# EAGLE design Arduino Sheild (EAGLE 6.2)
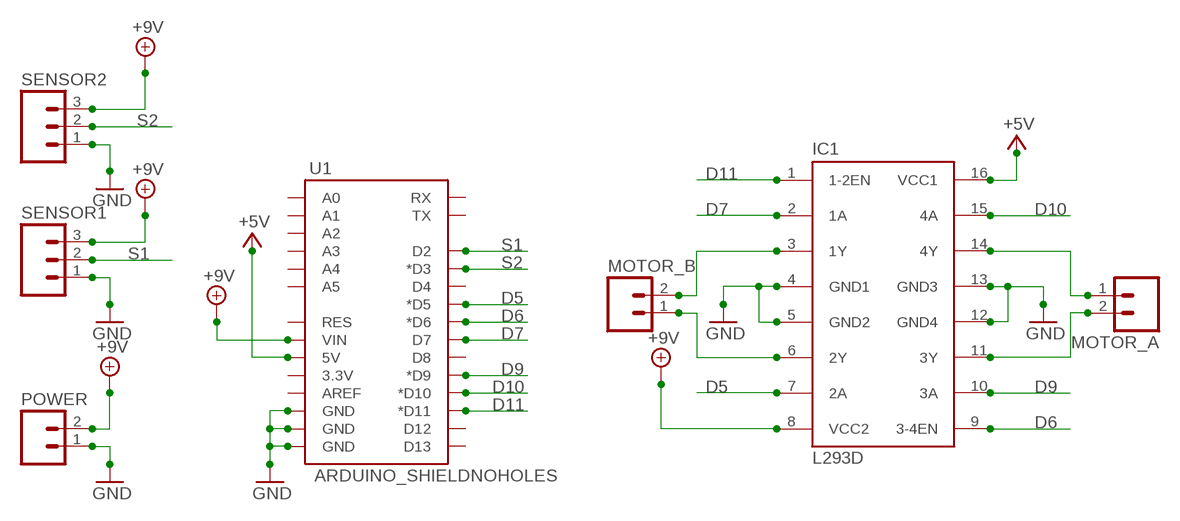
[diagram p0: schematic, sheet 1]

## Parts
IC1  L293D  [DIL16]
MOTOR_A  M02  [02P]
MOTOR_B  M02  [02P]
POWER  M02  [02P]
SENSOR1  M03  [03P]
SENSOR2  M03  [03P]
U1  ARDUINO_SHIELDNOHOLES  [DUEMILANOVE_SHIELD_NOHOLES]

## Nets
+5V: IC1.16(VCC1) U1.5V
+9V: IC1.8(VCC2) POWER.2 SENSOR1.3 SENSOR2.3 U1.VIN
D5: IC1.7(2A) U1.D5(*D5)
D6: IC1.9(3-4EN) U1.D6(*D6)
D7: IC1.2(1A) U1.D7
D9: IC1.10(3A) U1.D9(*D9)
D10: IC1.15(4A) U1.D10(*D10)
D11: IC1.1(1-2EN) U1.D11(*D11)
GND: IC1.4(GND1) IC1.5(GND2) IC1.12(GND4) IC1.13(GND3) POWER.1 SENSOR1.1 SENSOR2.1 U1.GND@0(GND) U1.GND@1(GND) U1.GND@2(GND)
N$3: IC1.3(1Y) MOTOR_B.2
N$4: IC1.6(2Y) MOTOR_B.1
N$5: IC1.14(4Y) MOTOR_A.1
N$6: IC1.11(3Y) MOTOR_A.2
S1: SENSOR1.2 U1.D2
S2: SENSOR2.2 U1.D3(*D3)
Unconnected: U1.3.3V U1.A0 U1.A1 U1.A2 U1.A3 U1.A4 U1.A5 U1.AREF U1.D4 U1.D8 U1.D12 U1.D13 U1.RES U1.RX U1.TX

## Library data of the parts
IC1 = st-microelectronics:L293D: PUSH-PULL 4 CHANNEL DRIVER; MPN: L293D; OC_FARNELL: 9589619; OC_NEWARK: 56P8249
MOTOR_A MOTOR_B POWER = con-amp-quick:M02: AMP QUICK CONNECTOR; OC_FARNELL: unknown; OC_NEWARK: unknown
SENSOR1 SENSOR2 = con-amp-quick:M03: AMP QUICK CONNECTOR; OC_FARNELL: unknown; OC_NEWARK: unknown
U1 = SparkFun-Boards:ARDUINO_SHIELD: Arduino shield footprint

## Board
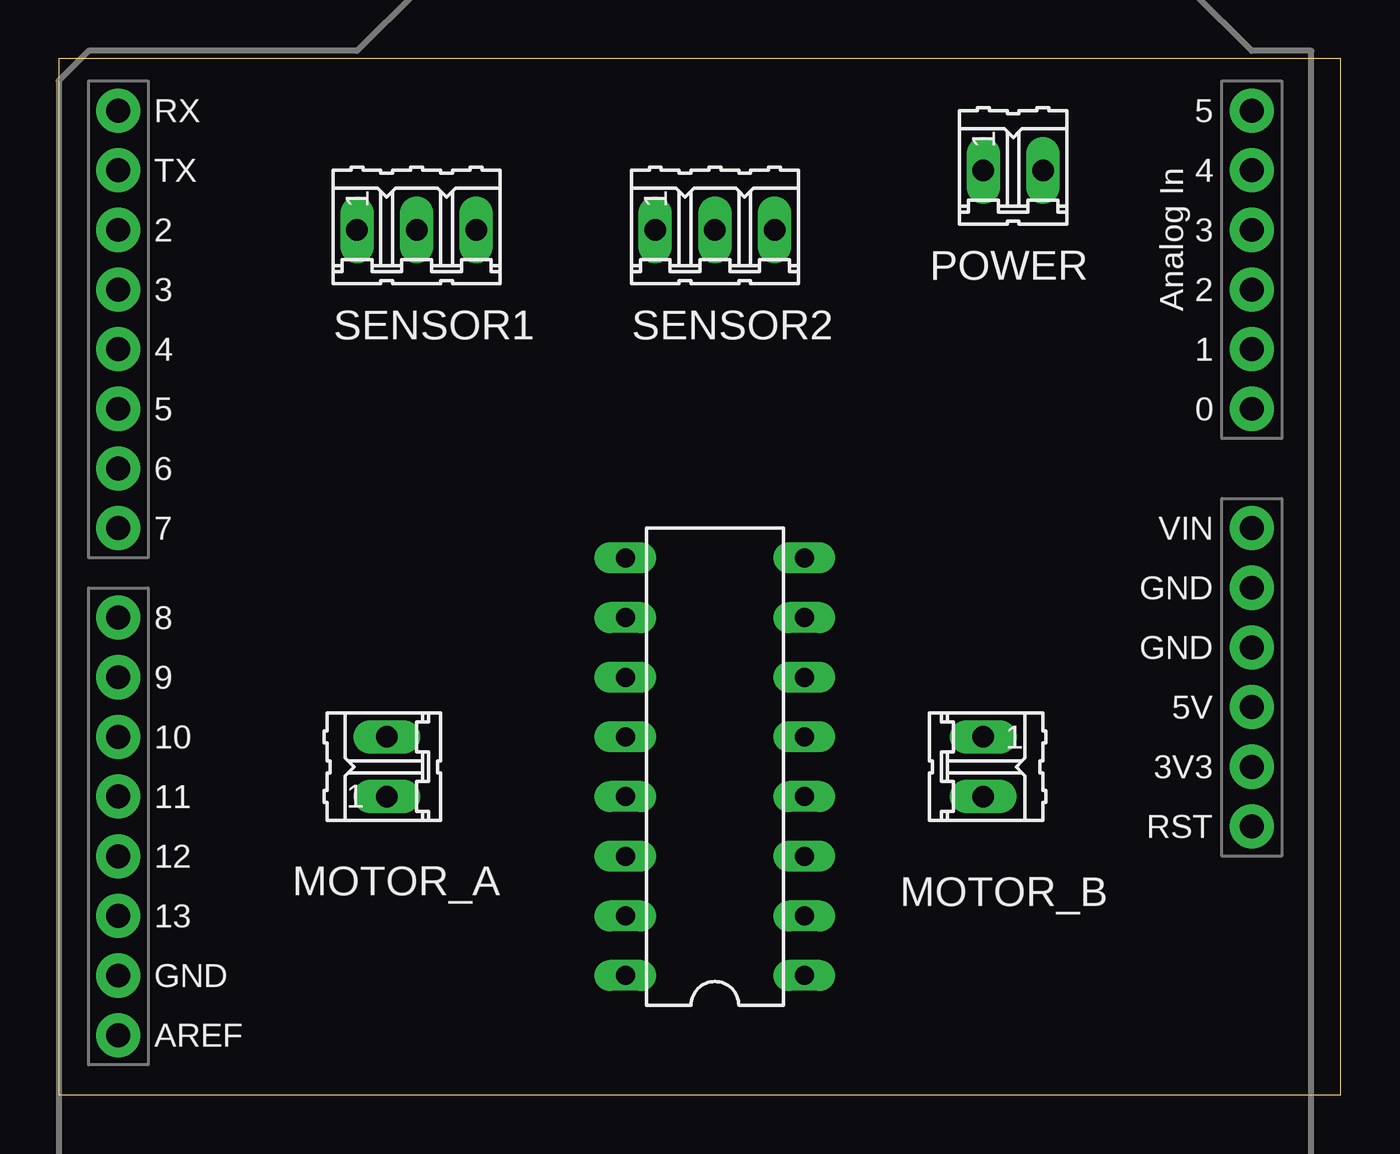
[diagram p1: board, top side]
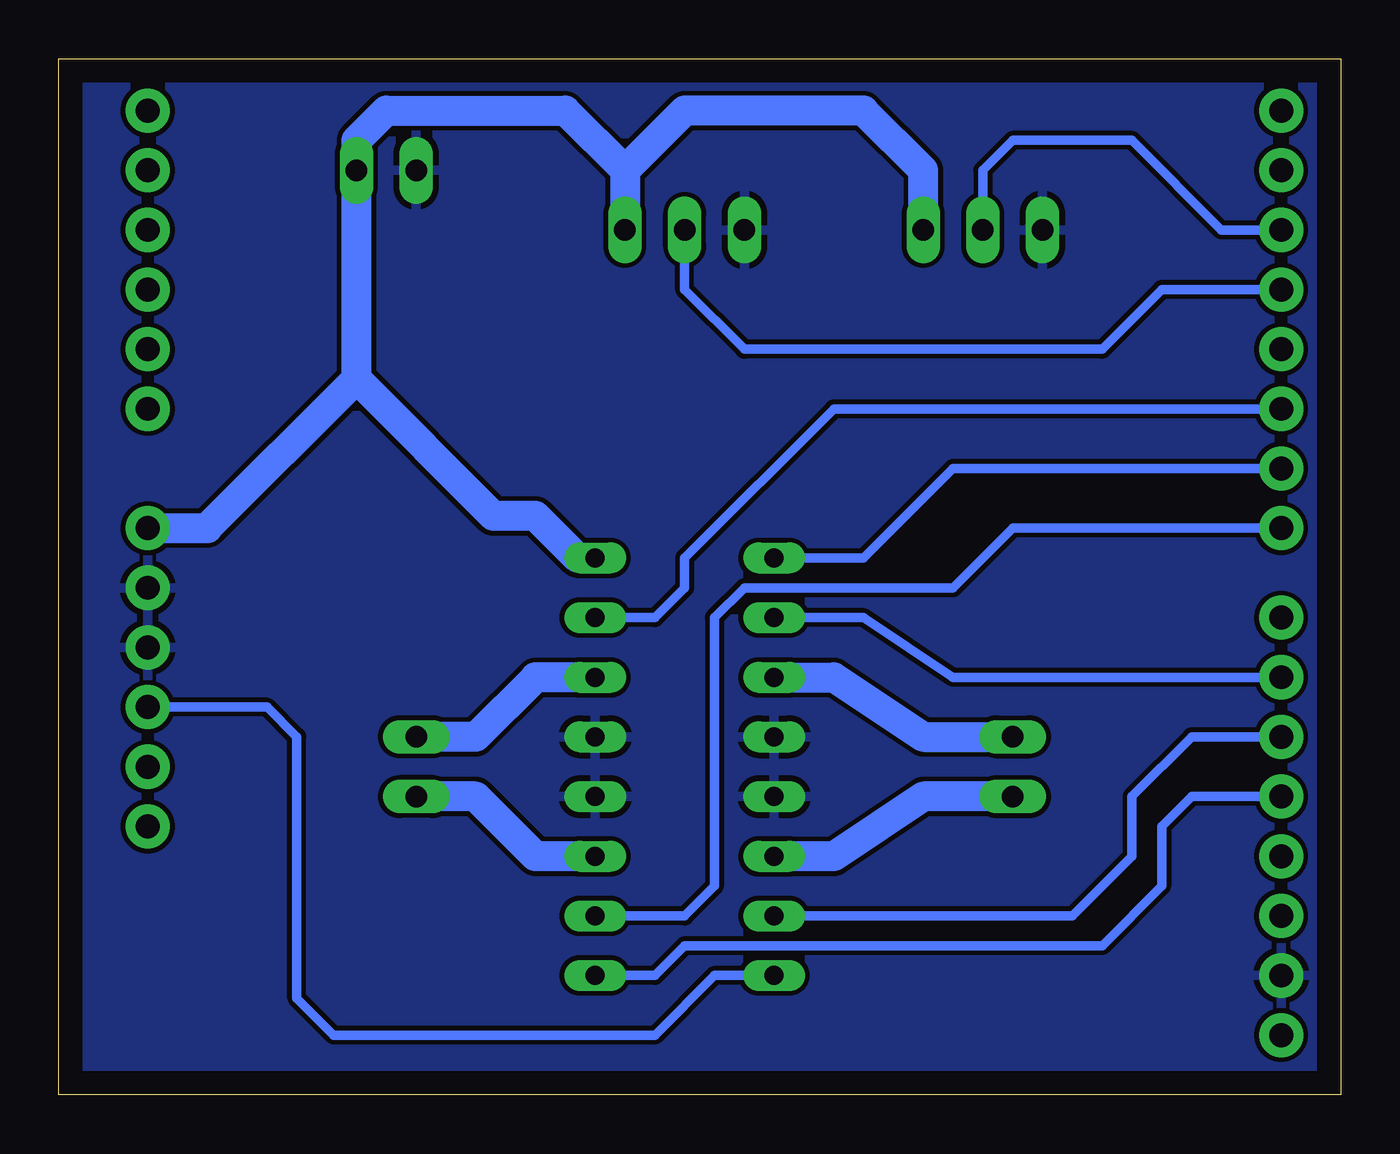
[diagram p2: board, bottom side, seen from below]

Size 54.59 x 44.12 mm. Coordinates in mm from the lower left corner, seen from the top.
Outline: 0,0 54.59,0 54.59,44.12 0,44.12 0,0
Copper layers (1*16): Top 0.035mm / dielectric 1.5mm / Bottom 0.035mm
Design rules: minimum track width 10mil, minimum drill 24mil, track to track 8mil, track to pad 8mil, pad to pad 8mil, via to via 8mil, smd to smd 8mil, copper to edge 40mil, drill to drill 8mil, minimum pad ring 10mil, minimum via ring 8mil, stop-mask expansion 4mil, vias tented up to drill 0mil, thermal gap 10mil

### Footprints (pad centres in the part's own frame; a part is rotated, then mirrored left to right if it is on the bottom)
DIL16 = drill 0.813 long: 1 -8.89,-3.81; 2 -6.35,-3.81; 3 -3.81,-3.81; 4 -1.27,-3.81; 5 1.27,-3.81; 6 3.81,-3.81; 7 6.35,-3.81; 8 8.89,-3.81; 9 8.89,3.81; 10 6.35,3.81; 11 3.81,3.81; 12 1.27,3.81; 13 -1.27,3.81; 14 -3.81,3.81; 15 -6.35,3.81; 16 -8.89,3.81
02P = drill 0.914 long: 1 -1.27,0; 2 1.27,0
03P = drill 0.914 long: 1 -2.54,0; 2 0,0; 3 2.54,0
DUEMILANOVE_SHIELD_NOHOLES = drill 1.016 pad 1.88: 3.3V 50.8,26.67; 5V 50.8,29.21; A0 50.8,41.91; A1 50.8,44.45; A2 50.8,46.99; A3 50.8,49.53; A4 50.8,52.07; A5 50.8,54.61; AREF 2.54,15.24; D2 2.54,49.53; D3 2.54,46.99; D4 2.54,44.45; D5 2.54,41.91; D6 2.54,39.37; D7 2.54,36.83; D8 2.54,33.02; D9 2.54,30.48; D10 2.54,27.94; D11 2.54,25.4; D12 2.54,22.86; D13 2.54,20.32; GND@0 50.8,31.75; GND@1 50.8,34.29; GND@2 2.54,17.78; RES 50.8,24.13; RX 2.54,54.61; TX 2.54,52.07; VIN 50.8,36.83

### Placement (x,y rotation side)
IC1  27.94,13.97 90 top
MOTOR_A  13.97,13.97 90 top
MOTOR_B  39.37,13.97 270 top
POWER  40.64,39.37 0 top
SENSOR1  15.24,36.83 0 top
SENSOR2  27.94,36.83 0 top
U1  0,-12.7 0 top

### Tracks (layer width: path | path; a pad name or v marks a point on that pad's centre or on a via)
+5V
  Bottom 0.406: IC1.16 26.67,5.08 29.21,2.54 42.88,2.54 44.45,4.11 44.45,15.24 45.72,16.51 U1.5V
+9V
  Bottom 1.27: IC1.8 32.49,22.86 34.29,24.66 36.09,24.66 41.91,30.48 | U1.VIN 48.26,24.13 41.91,30.48 | 41.91,30.48 POWER.2 41.91,40.64 40.64,41.91 33.02,41.91 30.48,39.37 | SENSOR1.3 17.78,39.37 20.32,41.91 27.94,41.91 30.48,39.37 | 30.48,39.37 SENSOR2.3
D5
  Bottom 0.406: U1.D5 21.59,29.21 27.94,22.86 27.94,21.59 29.21,20.32 IC1.7
D6
  Bottom 0.406: U1.D6 16.51,26.67 20.32,22.86 IC1.9
D7
  Bottom 0.406: U1.D7 13.97,24.13 16.51,21.59 25.4,21.59 26.67,20.32 26.67,8.89 27.94,7.62 IC1.2
D9
  Bottom 0.406: U1.D9 16.51,17.78 20.32,20.32 IC1.10
D10
  Bottom 0.406: U1.D10 6.35,15.24 8.89,12.7 8.89,10.16 11.43,7.62 IC1.15
D11
  Bottom 0.406: U1.D11 6.35,12.7 7.62,11.43 7.62,8.89 10.16,6.35 27.94,6.35 29.21,5.08 IC1.1
GND
  pour Bottom: 0,0 54.61,0 54.61,44.07 0,44.07
N$3
  Bottom 1.27: IC1.3 34.29,10.16 36.83,12.7 MOTOR_B.2
N$4
  Bottom 1.27: IC1.6 34.29,17.78 36.83,15.24 MOTOR_B.1
N$5
  Bottom 1.27: MOTOR_A.1 17.78,12.7 21.59,10.16 IC1.14
N$6
  Bottom 1.27: IC1.11 21.59,17.78 17.78,15.24 MOTOR_A.2
S1
  Bottom 0.406: U1.D2 5.08,36.83 8.89,40.64 13.97,40.64 15.24,39.37 SENSOR1.2
S2
  Bottom 0.406: U1.D3 7.62,34.29 10.16,31.75 25.4,31.75 27.94,34.29 SENSOR2.2